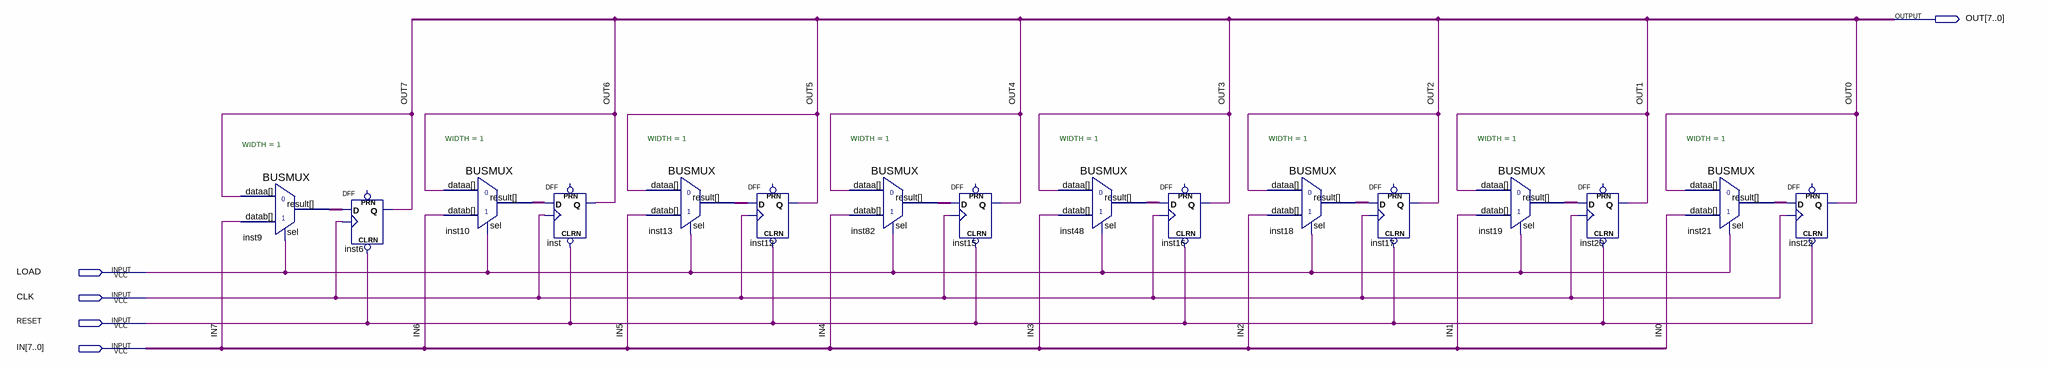
[diagram p0: schematic sheet]
// Quartus schematic 8bitregister.bdf as structural Verilog: 16 symbols, 5 pins
module \8bitregister  (
  input  LOAD,
  input  CLK,
  input  RESET,
  input  [7:0] IN,
  output [7:0] OUT
);

  wire inst9_result, inst10_result, inst13_result, inst18_result, inst19_result, inst21_result,
       inst48_result, inst82_result;

  BUSMUX #(.WIDTH(1)) inst9 (.datab(IN[7]), .sel(LOAD), .dataa(OUT[7]), .result(inst9_result));
  DFF inst6 (.CLRN(RESET), .CLK(CLK), .D(inst9_result), .Q(OUT[7]));  // open: PRN
  BUSMUX #(.WIDTH(1)) inst10 (.datab(IN[6]), .sel(LOAD), .dataa(OUT[6]), .result(inst10_result));
  DFF inst (.CLRN(RESET), .CLK(CLK), .D(inst10_result), .Q(OUT[6]));  // open: PRN
  BUSMUX #(.WIDTH(1)) inst13 (.datab(IN[5]), .sel(LOAD), .dataa(OUT[5]), .result(inst13_result));
  DFF inst12 (.CLRN(RESET), .CLK(CLK), .D(inst13_result), .Q(OUT[5]));  // open: PRN
  BUSMUX #(.WIDTH(1)) inst82 (.datab(IN[4]), .sel(LOAD), .dataa(OUT[4]), .result(inst82_result));
  DFF inst15 (.CLRN(RESET), .CLK(CLK), .D(inst82_result), .Q(OUT[4]));  // open: PRN
  BUSMUX #(.WIDTH(1)) inst48 (.datab(IN[3]), .sel(LOAD), .dataa(OUT[3]), .result(inst48_result));
  DFF inst16 (.CLRN(RESET), .CLK(CLK), .D(inst48_result), .Q(OUT[3]));  // open: PRN
  BUSMUX #(.WIDTH(1)) inst18 (.datab(IN[2]), .sel(LOAD), .dataa(OUT[2]), .result(inst18_result));
  DFF inst17 (.CLRN(RESET), .CLK(CLK), .D(inst18_result), .Q(OUT[2]));  // open: PRN
  BUSMUX #(.WIDTH(1)) inst19 (.datab(IN[1]), .sel(LOAD), .dataa(OUT[1]), .result(inst19_result));
  DFF inst20 (.CLRN(RESET), .CLK(CLK), .D(inst19_result), .Q(OUT[1]));  // open: PRN
  BUSMUX #(.WIDTH(1)) inst21 (.datab(IN[0]), .sel(LOAD), .dataa(OUT[0]), .result(inst21_result));
  DFF inst22 (.CLRN(RESET), .CLK(CLK), .D(inst21_result), .Q(OUT[0]));  // open: PRN
endmodule
